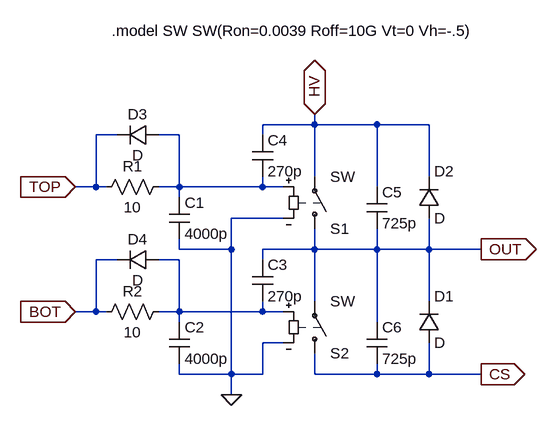
[diagram p0: schematic Driverx.asc]
Driverx.asc, the LTspice schematic file:
Version 4
SHEET 1 880 680
WIRE 144 80 144 64
WIRE 144 80 64 80
WIRE 240 80 144 80
WIRE 320 80 240 80
WIRE -160 96 -192 96
WIRE -64 96 -96 96
WIRE 64 96 64 80
WIRE 144 160 144 80
WIRE 320 160 320 80
WIRE -192 176 -192 96
WIRE -192 176 -224 176
WIRE -176 176 -192 176
WIRE -64 176 -64 96
WIRE -64 176 -96 176
WIRE 64 176 64 160
WIRE 64 176 -64 176
WIRE 96 176 64 176
WIRE 240 176 240 80
WIRE -64 192 -64 176
WIRE 96 224 16 224
WIRE -64 272 -64 256
WIRE 16 272 16 224
WIRE 16 272 -64 272
WIRE 144 272 144 240
WIRE 144 272 64 272
WIRE 240 272 240 240
WIRE 240 272 144 272
WIRE 320 272 320 224
WIRE 320 272 240 272
WIRE 400 272 320 272
WIRE -160 288 -192 288
WIRE -64 288 -96 288
WIRE 64 288 64 272
WIRE 144 352 144 272
WIRE 320 352 320 272
WIRE -192 368 -192 288
WIRE -192 368 -224 368
WIRE -176 368 -192 368
WIRE -64 368 -64 288
WIRE -64 368 -96 368
WIRE 64 368 64 352
WIRE 64 368 -64 368
WIRE 96 368 64 368
WIRE -64 384 -64 368
WIRE 240 384 240 272
WIRE 96 416 64 416
WIRE -64 464 -64 448
WIRE 16 464 16 272
WIRE 16 464 -64 464
WIRE 64 464 64 416
WIRE 64 464 16 464
WIRE 144 464 144 432
WIRE 240 464 240 448
WIRE 240 464 144 464
WIRE 320 464 320 416
WIRE 320 464 240 464
WIRE 400 464 320 464
WIRE 16 496 16 464
FLAG 16 496 0
FLAG -224 176 TOP
IOPIN -224 176 In
FLAG -224 368 BOT
IOPIN -224 368 In
FLAG 400 272 OUT
IOPIN 400 272 Out
FLAG 144 64 HV
IOPIN 144 64 BiDir
FLAG 400 464 CS
IOPIN 400 464 Out
SYMBOL sw 144 256 M180
SYMATTR InstName S1
SYMBOL sw 144 448 M180
SYMATTR InstName S2
SYMBOL diode 304 416 M180
WINDOW 0 24 72 Left 0
WINDOW 3 24 0 Left 0
SYMATTR InstName D1
SYMBOL diode 304 224 M180
WINDOW 0 24 72 Left 0
WINDOW 3 24 0 Left 0
SYMATTR InstName D2
SYMBOL cap -80 192 R0
SYMATTR InstName C1
SYMATTR Value 4000p
SYMBOL cap -80 384 R0
SYMATTR InstName C2
SYMATTR Value 4000p
SYMBOL res -80 160 R90
WINDOW 0 0 56 VBottom 0
WINDOW 3 32 56 VTop 0
SYMATTR InstName R1
SYMATTR Value 10
SYMBOL res -80 352 R90
WINDOW 0 0 56 VBottom 0
WINDOW 3 32 56 VTop 0
SYMATTR InstName R2
SYMATTR Value 10
SYMBOL diode -96 80 R90
WINDOW 0 0 32 VBottom 0
WINDOW 3 32 32 VTop 0
SYMATTR InstName D3
SYMBOL diode -96 272 R90
WINDOW 0 0 32 VBottom 0
WINDOW 3 32 32 VTop 0
SYMATTR InstName D4
SYMBOL cap 48 288 R0
SYMATTR InstName C3
SYMATTR Value 270p
SYMBOL cap 48 96 R0
SYMATTR InstName C4
SYMATTR Value 270p
SYMBOL cap 224 176 R0
SYMATTR InstName C5
SYMATTR Value 725p
SYMBOL cap 224 384 R0
SYMATTR InstName C6
SYMATTR Value 725p
TEXT -168 -64 Left 0 !.model SW SW(Ron=0.0039 Roff=10G Vt=0 Vh=-.5)

The netlist it stands for:
* Driverx.asc
S1 OUT HV N001 0 SW
S2 CS OUT N002 0 SW
D1 CS OUT D
D2 OUT HV D
C1 N001 0 4000p
C2 N002 0 4000p
R1 N001 TOP 10
R2 N002 BOT 10
D3 N001 TOP D
D4 N002 BOT D
C3 OUT N002 270p
C4 HV N001 270p
C5 HV OUT 725p
C6 OUT CS 725p
.model D D
.lib standard.dio
.model SW SW(Ron=0.0039 Roff=10G Vt=0 Vh=-.5)
.backanno
.end